# EAGLE design adc_guarded_newinput (EAGLE 5.11)
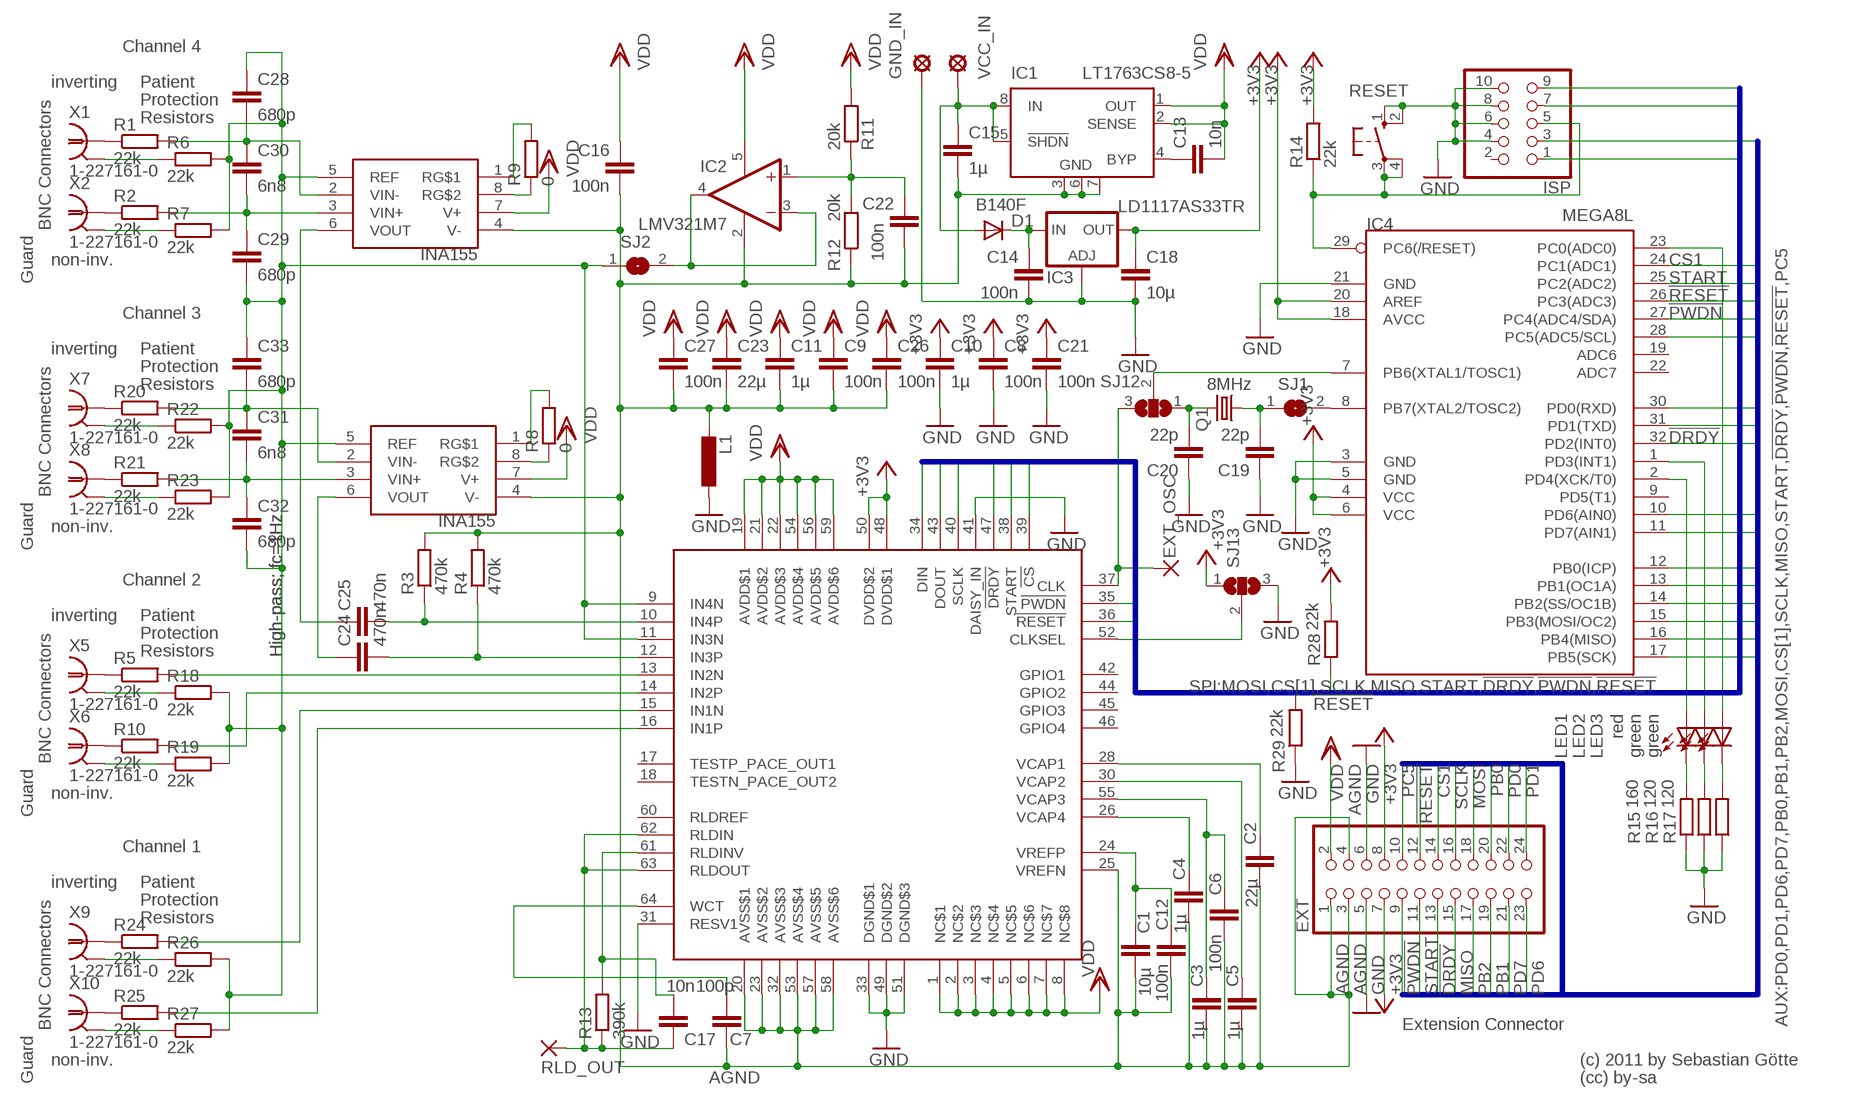
[diagram p0: schematic, sheet 1]

## Parts
C1  10µ  C-EUC0805K  [C0805K]
C2  22µ  C-EUC1206  [C1206]
C3  1µ  C-EUC0805K  [C0805K]
C4  1µ  C-EUC0805K  [C0805K]
C5  1µ  C-EUC0805K  [C0805K]
C6  100n  C-EUC0805K  [C0805K]
C7  100p  C-EUC0805K  [C0805K]
C8  100n  C-EUC0805K  [C0805K]
C9  100n  C-EUC0805K  [C0805K]
C10  1µ  C-EUC0805  [C0805]
C11  1µ  C-EUC0805K  [C0805K]
C12  100n  C-EUC0805K  [C0805K]
C13  10n  C-EUC0805K  [C0805K]
C14  100n  C-EUC0805K  [C0805K]
C15  1µ  C-EUC0805K  [C0805K]
C16  100n  C-EUC0805  [C0805]
C17  10n  C-EUC0805K  [C0805K]
C18  10µ  C-EUC0805K  [C0805K]
C19  22p  C-EUC0805K  [C0805K]
C20  22p  C-EUC0805K  [C0805K]
C21  100n  C-EUC0805K  [C0805K]
C22  100n  C-EUC0805  [C0805]
C23  22µ  C-EUC1206  [C1206]
C24  470n  C-EUC0805K  [C0805K]
C25  470n  C-EUC0805K  [C0805K]
C26  100n  C-EUC0805K  [C0805K]
C27  100n  C-EUC0805K  [C0805K]
C28  680p  C-EUC0805  [C0805]
C29  680p  C-EUC0805  [C0805]
C30  6n8  C-EUC0805  [C0805]
C31  6n8  C-EUC0805  [C0805]
C32  680p  C-EUC0805  [C0805]
C33  680p  C-EUC0805  [C0805]
D1  B140F  DIODE-DO214AC  [DO214AC]
EXT  PINHD-2X12  [2X12]
EXT_OSC  1,6/0,8  [1,6/0,8]
GND_IN  MCS10B  [MCS10B]
IC1  LT1763CS8-5  LT1763CS8-3.3  [SOIC8]
IC2  LMV321M7  [SC70-5L]
IC3  LD1117AS33TR  LD117AS33TR  [SOT223]
IC4  MEGA8L  MEGA8-AI  [TQFP32-08]
ISP  PINHD-2X5  [2X05]
L1  L-EUPIS2816  [PIS2816]
LED1  red  LEDCHIPLED_1206  [CHIPLED_1206]
LED2  green  LEDCHIPLED_1206  [CHIPLED_1206]
LED3  green  LEDCHIPLED_1206  [CHIPLED_1206]
Q1  8MHz  CRYSTALHC49UP  [HC49UP]
R1  22k  R-EU_R1206  [R1206]
R2  22k  R-EU_R1206  [R1206]
R3  470k  R-EU_R1206  [R1206]
R4  470k  R-EU_R1206  [R1206]
R5  22k  R-EU_R1206  [R1206]
R6  22k  R-EU_R1206  [R1206]
R7  22k  R-EU_R1206  [R1206]
R8  0  R-EU_R1206  [R1206]
R9  0  R-EU_R1206  [R1206]
R10  22k  R-EU_R1206  [R1206]
R11  20k  R-EU_R1206  [R1206]
R12  20k  R-EU_R1206  [R1206]
R13  390k  R-EU_R1206  [R1206]
R14  22k  R-EU_R1206  [R1206]
R15  160  R-EU_R1206  [R1206]
R16  120  R-EU_R1206  [R1206]
R17  120  R-EU_R1206  [R1206]
R18  22k  R-EU_R1206  [R1206]
R19  22k  R-EU_R1206  [R1206]
R20  22k  R-EU_R1206  [R1206]
R21  22k  R-EU_R1206  [R1206]
R22  22k  R-EU_R1206  [R1206]
R23  22k  R-EU_R1206  [R1206]
R24  22k  R-EU_R1206  [R1206]
R25  22k  R-EU_R1206  [R1206]
R26  22k  R-EU_R1206  [R1206]
R27  22k  R-EU_R1206  [R1206]
R28  22k  R-EU_R1206  [R1206]
R29  22k  R-EU_R1206  [R1206]
RESET  10-XX  [B3F-10XX]
RLD_OUT  2,54/1,0  [2,54/1,0]
SJ1  SJ  [SJ]
SJ2  SJ  [SJ]
SJ12  SJ2W  [SJ_2]
SJ13  SJ2W  [SJ_2]
U$1  ADS1194  [TQFP-64]
U$2  INA155  [SO-08]
U$3  INA155  [SO-08]
VCC_IN  MCS10B  [MCS10B]
X1  1-227161-0  [AMP_227161]
X2  1-227161-0  [AMP_227161]
X5  1-227161-0  [AMP_227161]
X6  1-227161-0  [AMP_227161]
X7  1-227161-0  [AMP_227161]
X8  1-227161-0  [AMP_227161]
X9  1-227161-0  [AMP_227161]
X10  1-227161-0  [AMP_227161]

## Nets
!DRDY: EXT.13 IC4.32(PD2(INT0)) U$1.47(!DRDY)
!PWDN: EXT.9 IC4.27(PC4(ADC4/SDA)) U$1.35(!PWDN)
!RESET: EXT.12 IC4.26(PC3(ADC3)) R29.2 U$1.36(!RESET)
+3V3: C8.1 C10.1 C18.1 C21.1 EXT.7 EXT.8 IC3.4(OUT) IC4.4(VCC) IC4.6(VCC) IC4.18(AVCC) IC4.20(AREF) R14.2 R28.2 SJ13.1 U$1.48(DVDD$1) U$1.50(DVDD$2)
AGND: C1.2 C2.2 C3.2 C4.2 C5.2 C6.2 C7.1 C9.2 C11.2 C12.2 C15.2 C16.2 C22.2 C23.2 C26.2 C27.2 EXT.1 EXT.3 EXT.4 IC1.3(GND) IC1.6(GND) IC1.7(GND) IC2.2(V-) L1.2 R3.2 R4.2 R12.1 U$1.20(AVSS$1) U$1.23(AVSS$2) U$1.25(VREFN) U$1.32(AVSS$3) U$1.53(AVSS$4) U$1.57(AVSS$5) U$1.58(AVSS$6) U$2.4(V-) U$3.4(V-)
CLK: EXT_OSC.1(P) SJ12.3 U$1.37(CLK)
CLKSEL: SJ13.2 U$1.52(CLKSEL)
CS1: EXT.14 IC4.24(PC1(ADC1)) R28.1 U$1.39(!CS)
GND: C8.2 C10.2 C14.2 C18.2 C19.1 C20.1 C21.2 EXT.5 EXT.6 GND_IN.MP IC3.1(ADJ) IC4.3(GND) IC4.5(GND) IC4.21(GND) ISP.4 ISP.6 ISP.8 ISP.10 L1.1 R15.1 R16.1 R17.1 R29.1 RESET.1(S) RESET.2(S1) SJ13.3 U$1.31(RESV1) U$1.33(DGND$1) U$1.41(DAISY_IN) U$1.49(DGND$2) U$1.51(DGND$3)
MISO: EXT.15 IC4.16(PB4(MISO)) ISP.9 U$1.43(DOUT)
MOSI: EXT.18 IC4.15(PB3(MOSI/OC2)) ISP.1 U$1.34(DIN)
N$1: C2.1 U$1.28(VCAP1)
N$2: C4.1 U$1.26(VCAP4)
N$3: C7.2 U$1.64(WCT)
N$4: C5.1 U$1.30(VCAP2)
N$5: C3.1 C6.1 U$1.55(VCAP3)
N$6: C1.1 C12.1 U$1.24(VREFP)
N$7: R9.1 U$2.8(RG$2)
N$8: IC2.3(-IN) IC2.4(OUT) SJ2.2
N$9: C25.2 R3.1 U$1.10(IN4P)
N$10: C14.1 D1.C IC3.3(IN)
N$11: R5.2 U$1.13(IN2N)
N$12: C29.1 C30.2 R2.2 U$2.3(VIN+)
N$13: C28.2 C30.1 R1.2 U$2.2(VIN-)
N$14: R5.1 X5.1
N$15: R10.1 X6.1
N$16: C13.1 IC1.4(BYP)
N$17: R1.1 X1.1
N$18: R2.1 X2.1
N$19: R9.2 U$2.1(RG$1)
N$20: C25.1 U$2.6(VOUT)
N$21: R19.1 X6.2(GND)
N$22: R18.1 X5.2(GND)
N$23: R20.1 X7.1
N$24: R10.2 U$1.14(IN2P)
N$25: R8.2 U$3.1(RG$1)
N$26: C24.1 U$3.6(VOUT)
N$27: R21.1 X8.1
N$28: C31.1 C33.2 R20.2 U$3.2(VIN-)
N$29: C31.2 C32.1 R21.2 U$3.3(VIN+)
N$30: R7.1 X2.2(GND)
N$31: R6.1 X1.2(GND)
N$32: C24.2 R4.1 U$1.12(IN3P)
N$33: R8.1 U$3.8(RG$2)
N$34: C17.2 R13.2 U$1.61(RLDINV)
N$35: C20.2 Q1.2 SJ12.1
N$36: R24.2 U$1.15(IN1N)
N$37: R25.2 U$1.16(IN1P)
N$38: C19.2 Q1.1 SJ1.1
N$40: IC4.7(PB6(XTAL1/TOSC1)) SJ12.2
N$41: IC4.23(PC0(ADC0)) LED3.A
N$42: IC4.1(PD3(INT1)) LED2.A
N$43: IC4.2(PD4(XCK/T0)) LED1.A
N$44: LED1.C R15.2
N$45: LED2.C R16.2
N$46: LED3.C R17.2
N$48: IC4.8(PB7(XTAL2/TOSC2)) SJ1.2
N$51: C28.1 C29.2 C32.2 C33.1 R6.2 R7.2 R18.2 R19.2 R22.2 R23.2 R26.2 R27.2 SJ2.1 U$1.9(IN4N) U$1.11(IN3N) U$2.5(REF) U$3.5(REF)
N$58: R23.1 X8.2(GND)
N$59: R22.1 X7.2(GND)
N$63: R24.1 X9.1
N$64: R25.1 X10.1
N$65: R27.1 X10.2(GND)
N$66: R26.1 X9.2(GND)
PB0: EXT.20 IC4.12(PB0(ICP))
PB1: EXT.19 IC4.13(PB1(OC1A))
PB2: EXT.17 IC4.14(PB2(SS/OC1B))
PC5: EXT.10 IC4.28(PC5(ADC5/SCL))
PD0: EXT.22 IC4.30(PD0(RXD))
PD1: EXT.24 IC4.31(PD1(TXD))
PD6: EXT.23 IC4.10(PD6(AIN0)) ISP.3
PD7: EXT.21 IC4.11(PD7(AIN1))
REF_NODE: C22.1 IC2.1(+IN) R11.1 R12.2
RLD_OUT: C17.1 R13.1 RLD_OUT.1(P) U$1.62(RLDIN) U$1.63(RLDOUT)
SCLK: EXT.16 IC4.17(PB5(SCK)) ISP.7 U$1.40(SCLK)
START: EXT.11 IC4.25(PC2(ADC2)) U$1.38(START)
UCRESET: IC4.29(PC6(/RESET)) ISP.5 R14.1 RESET.3(P) RESET.4(P1)
VCC_IN: C15.1 D1.A IC1.5(!SHDN) IC1.8(IN) VCC_IN.MP
VDD: C9.1 C11.1 C13.2 C16.1 C23.1 C26.1 C27.1 EXT.2 IC1.1(OUT) IC1.2(SENSE) IC2.5(V+) R11.2 U$1.1(NC$1) U$1.2(NC$2) U$1.3(NC$3) U$1.4(NC$4) U$1.5(NC$5) U$1.6(NC$6) U$1.7(NC$7) U$1.8(NC$8) U$1.19(AVDD$1) U$1.21(AVDD$2) U$1.22(AVDD$3) U$1.54(AVDD$4) U$1.56(AVDD$5) U$1.59(AVDD$6) U$2.7(V+) U$3.7(V+)
Unconnected: IC4.9(PD5(T1)) IC4.19(ADC6) IC4.22(ADC7) ISP.2 U$1.17(TESTP_PACE_OUT1) U$1.18(TESTN_PACE_OUT2) U$1.42(GPIO1) U$1.44(GPIO2) U$1.45(GPIO3) U$1.46(GPIO4) U$1.60(RLDREF)

## Buses
SPI:MOSI,CS[1],SCLK,MISO,START,!DRDY,!PWDN,!RESET
AUX:PD0,PD1,PD6,PD7,PB0,PB1,PB2,MOSI,CS[1],SCLK,MISO,START,!DRDY,!PWDN,!RESET,PC5

## Notes on the sheet
- Channel 4
- inverting | Patient
- Protection
- Resistors
- BNC Connectors
- INA155
- non-inv.
- Guard
- Channel 3
- inverting | Patient
- Protection
- Resistors
- BNC Connectors
- INA155
- non-inv.
- Guard
- Channel 2
- inverting | Patient
- Protection
- Resistors | High-pass; fc=1Hz | High-pass; fc=1Hz
- BNC Connectors
- non-inv.
- Guard
- Channel 1
- inverting | Patient
- Protection
- Resistors
- BNC Connectors | Extension Connector
- non-inv. | (c) 2011 by Sebastian Götte
- Guard | AGND | (cc) by-sa

## Library data of the parts
C1-C33 = rcl:C-EU: CAPACITOR, European symbol
D1 = diode:DIODE-: DIODE
EXT = pinhead:PINHD-2X12: PIN HEADER
EXT_OSC = wirepad:1,6/0,8: THROUGH-HOLE PAD
GND_IN VCC_IN = solpad:MCS10B: SOLDER PAD MC S1, distributor Buerklin, 15F505
IC1 = linear-technology:LT1763CS8: 500mA, Low Noise, LDO Micropower Regulators Source: http://cds.linear.com/docs/Datasheet/1763ff.pdf
IC2 = linear:LMV321?*: General Purpose, Low Voltage, Rail-to-Rail Output Operational Amplifiers Source: http://www.national.com/mpf/LM/LMV321.html http://www.national.com/dt/lmv_qual.pdf
IC3 = v-reg:LD117A?*: Low drop fixed and adjustable positive voltage regulators 1 A Source: http://www.st.com/stonline/products/literature/ds/7194/ld1117axx.pdf
IC4 = atmel:MEGA8: MICROCONTROLLER 8 Kbytes FLASH, 1 kbytes SRAM, 512 bytes EEPROM, USART, 6-channel 10 bit ADC, 2-channel 8 bit ADC Pin compatible with Atmega48, ATMega88, ATMega168 Source: avr.lbr
ISP = pinhead:PINHD-2X5: PIN HEADER
L1 = rcl:L-EU: INDUCTOR, European symbol
LED1-LED3 = led:LED: LED OSRAM: - CHIPLED LG R971, LG N971, LY N971, LG Q971, LY Q971, LO R971, LY R971 LH N974, LH R974 LS Q976, LO Q976, LY Q976 LO Q996 - Hyper CHIPLED LW Q18S LB Q993, LB Q99A, LB R99A - SideLED LS A670, LO A670, LY A670, LG A670, LP A670 LB A673, LV A673, LT A673, LW A673 LH A674 LY A675 LS A676, LA A676, LO A676, LY A676, LW A676 LS A679, LY A679, LG A679 - Hyper Micro SIDELED® LS Y876, LA Y876, LO Y876, LY Y876 LT Y87S - SmartLED LW L88C, LW L88S LB L89C, LB L89S, LG L890 LS L89K, LO L89K, LY L89K LS L896, LA L896, LO L896, LY L896 - TOPLED LS T670, LO T670, LY T670, LG T670, LP T670 LSG T670, LSP T670, LSY T670, LOP T670, LYG T670 LG T671, LOG T671, LSG T671 LB T673, LV T673, LT T673, LW T673 LH T674 LS T676, LA T676, LO T676, LY T676, LB T676, LH T676, LSB T676, LW T676 LB T67C, LV T67C, LT T67C, LS T67K, LO T67K, LY T67K, LW E67C LS E67B, LA E67B, LO E67B, LY E67B, LB E67C, LV E67C, LT E67C LW T67C LS T679, LY T679, LG T679 LS T770, LO T770, LY T770, LG T770, LP T770 LB T773, LV T773, LT T773, LW T773 LH T774 LS E675, LA E675, LY E675, LS T675 LS T776, LA T776, LO T776, LY T776, LB T776 LHGB T686 LT T68C, LB T68C - Hyper Mini TOPLED® LB M676 - Mini TOPLED Santana® LG M470 LS M47K, LO M47K, LY M47K Source: http://www.osram.convergy.de LUXEON: - LUMILED® LXK2-PW12-R00, LXK2-PW12-S00, LXK2-PW14-U00, LXK2-PW14-V00 LXK2-PM12-R00, LXK2-PM12-S00, LXK2-PM14-U00 LXK2-PE12-Q00, LXK2-PE12-R00, LXK2-PE12-S00, LXK2-PE14-T00, LXK2-PE14-U00 LXK2-PB12-K00, LXK2-PB12-L00, LXK2-PB12-M00, LXK2-PB14-N00, LXK2-PB14-P00, LXK2-PB14-Q00 LXK2-PR12-L00, LXK2-PR12-M00, LXK2-PR14-Q00, LXK2-PR14-R00 LXK2-PD12-Q00, LXK2-PD12-R00, LXK2-PD12-S00 LXK2-PH12-R00, LXK2-PH12-S00 LXK2-PL12-P00, LXK2-PL12-Q00, LXK2-PL12-R00 Source: www.luxeon.com KINGBRIGHT: KA-3528ASYC Source: www.kingbright.com
Q1 = crystal:CRYSTAL: CRYSTAL
R1-R29 = rcl:R-EU_: RESISTOR, European symbol
RESET = switch-omron:10-XX: OMRON SWITCH; MPN: B3F-1000; OC_FARNELL: 176432; OC_NEWARK: 36M3542
RLD_OUT = wirepad:2,54/1,0: THROUGH-HOLE PAD
SJ1 SJ2 = jumper:SJ: SMD solder JUMPER
SJ12 SJ13 = jumper:SJ2W: SMD solder JUMPER
U$1 = mytexas:ADS1194: Low-Power, 8-Channel, 16-Bit Analog Front-End for Biopotential Measurements for ECG/EEG applications
U$2 U$3 = mytexas:INA155: Single-Supply, Rail-to-Rail Output, CMOS INSTRUMENTATION AMPLIFIER
X1 X2 X5-X10 = con-coax:?227161*: JACK, RIGHT ANGLE, 50 OHM, PCB, BNC Source: amp_227161.pdf

## Board
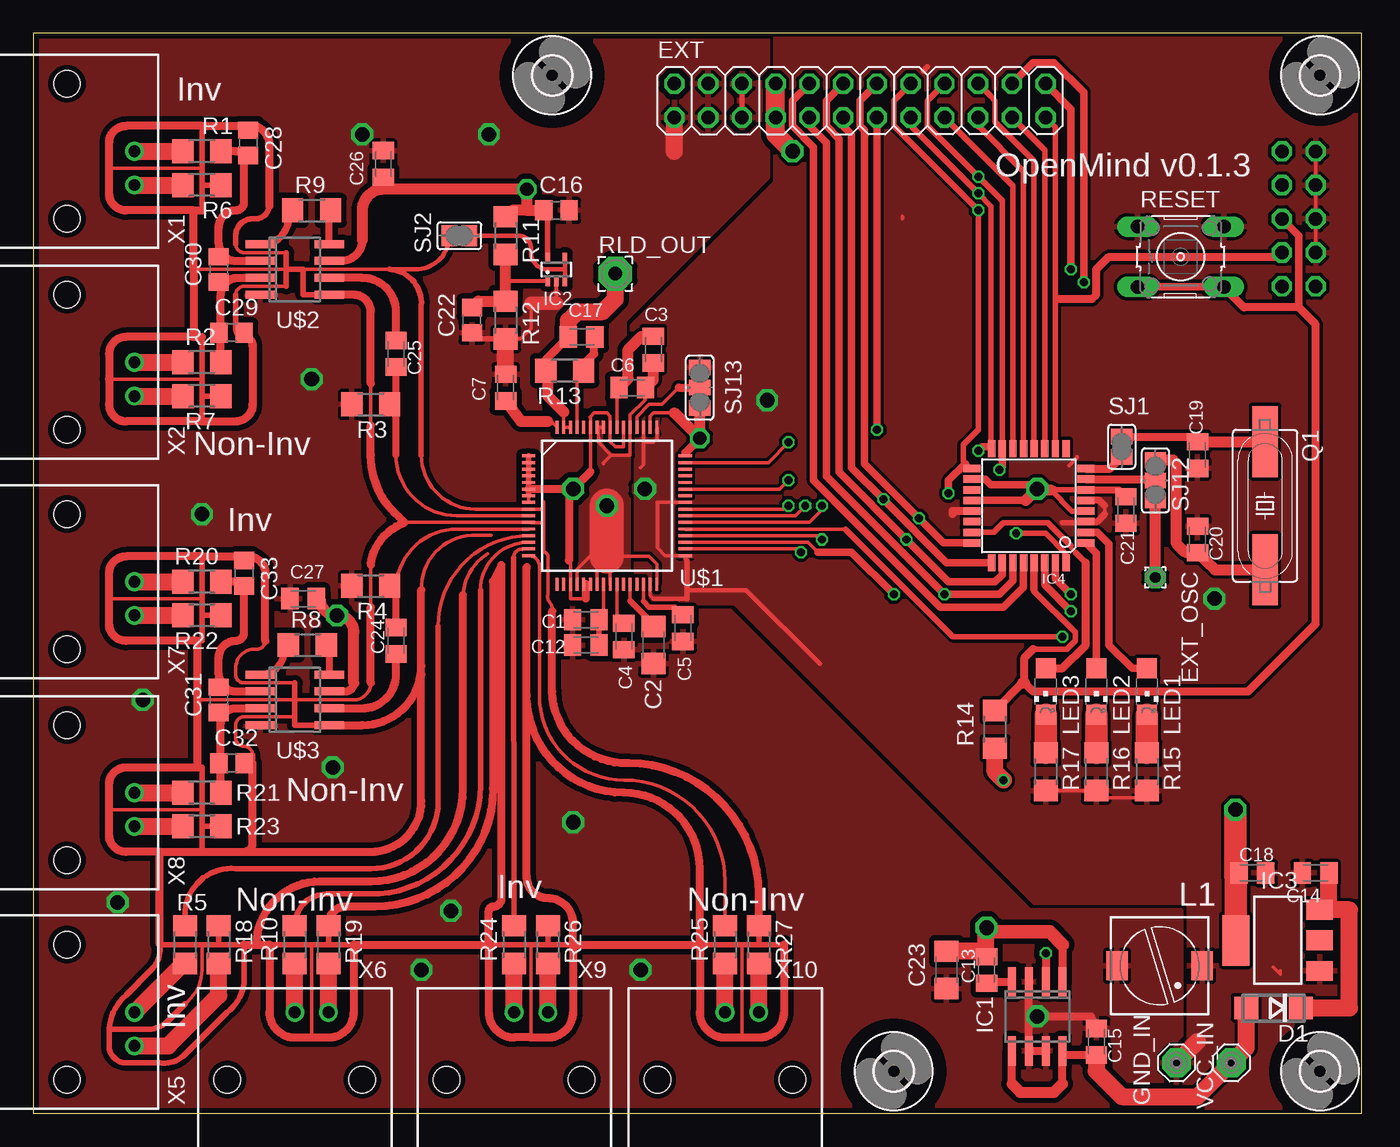
[diagram p1: board, top side]
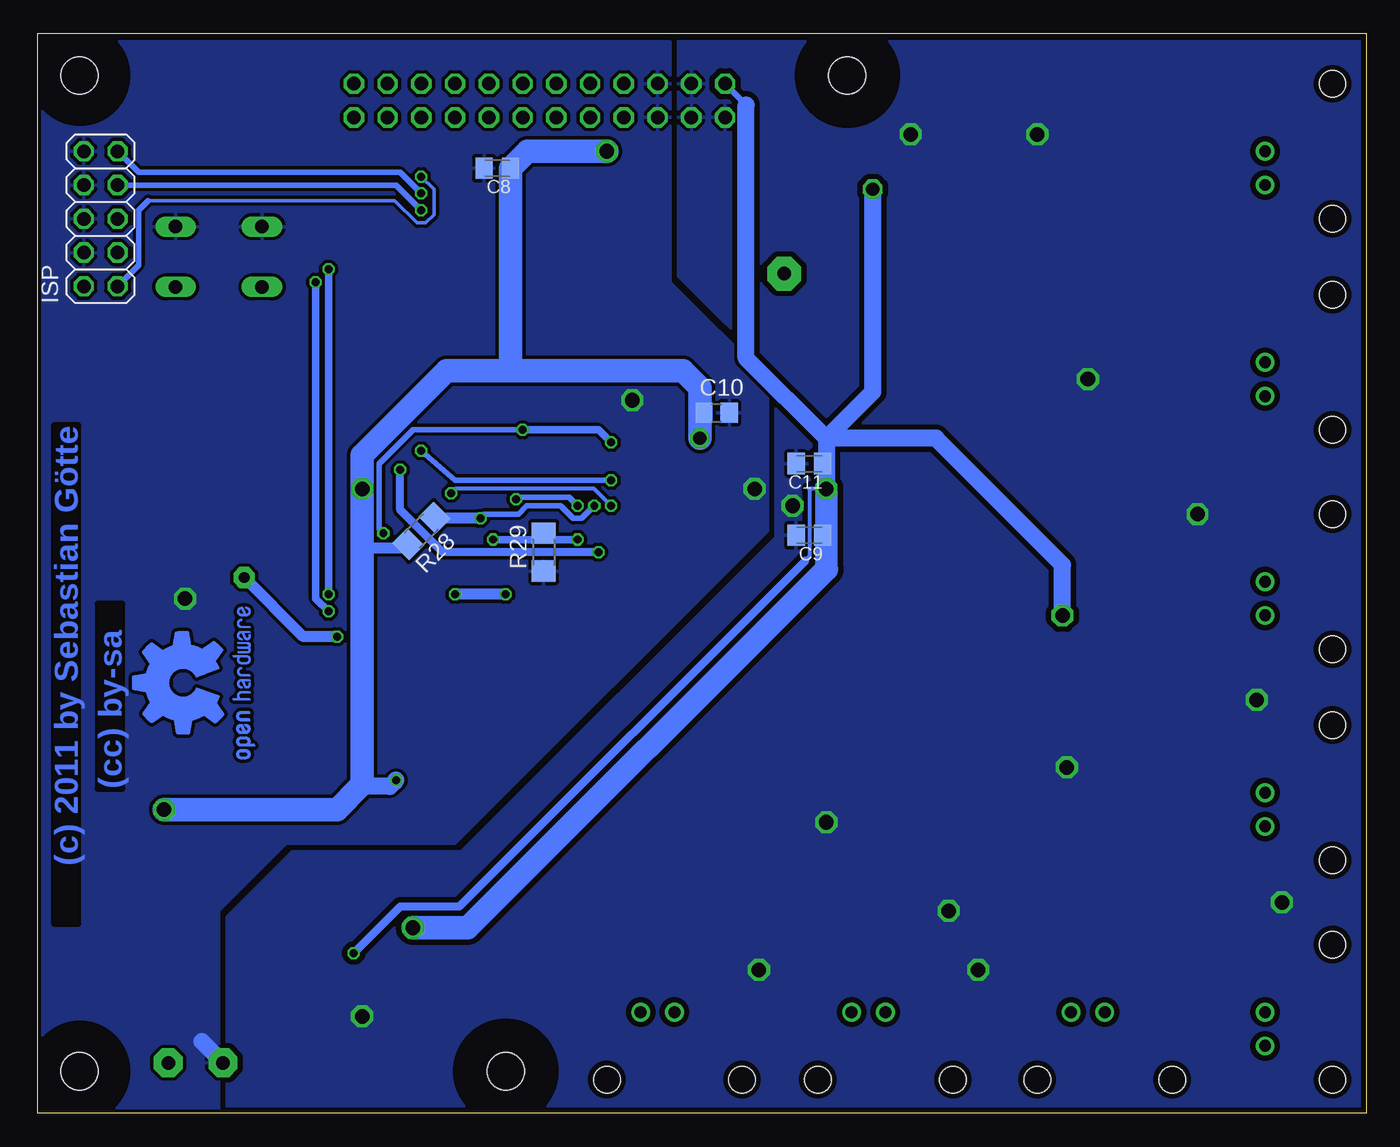
[diagram p2: board, bottom side, seen from below]

Size 100 x 81.27 mm. Coordinates in mm from the lower left corner, seen from the top.
Outline: 0,0 100,0 100,81.27 0,81.27 0,0
Copper layers (1*16): Top 0.035mm / dielectric 1.5mm / Bottom 0.035mm
Design rules "Fusion_eagle_rule_v1.1": minimum track width 6mil, minimum drill 12mil, track to track 6mil, track to pad 6mil, pad to pad 6mil, via to via 6mil, smd to smd 0mil, copper to edge 10mil, drill to drill 10mil, minimum pad ring 10mil, minimum via ring 6mil, stop-mask expansion 2mil, vias tented up to drill 100mil, thermal gap 10mil

### Footprints (pad centres in the part's own frame; a part is rotated, then mirrored left to right if it is on the bottom)
C0805K = smd 1.3 x 1.6: 1 -1,0; 2 1,0
C1206 = smd 1.6 x 1.8: 1 -1.4,0; 2 1.4,0
C0805 = smd 1.3 x 1.5: 1 -0.95,0; 2 0.95,0
DO214AC = smd 1.8 x 1.7: A 2.05,0; C -2.05,0
2X12 = drill 1.016 octagon: 1 -13.97,-1.27; 2 -13.97,1.27; 3 -11.43,-1.27; 4 -11.43,1.27; 5 -8.89,-1.27; 6 -8.89,1.27; 7 -6.35,-1.27; 8 -6.35,1.27; 9 -3.81,-1.27; 10 -3.81,1.27; 11 -1.27,-1.27; 12 -1.27,1.27; 13 1.27,-1.27; 14 1.27,1.27; 15 3.81,-1.27; 16 3.81,1.27; 17 6.35,-1.27; 18 6.35,1.27; 19 8.89,-1.27; 20 8.89,1.27; 21 11.43,-1.27; 22 11.43,1.27; 23 13.97,-1.27; 24 13.97,1.27
1,6/0,8 = drill 0.813 pad 1.6 octagon: 1 0,0
MCS10B = drill 1.016 pad 2.159 octagon: MP 0,0
SOIC8 = smd 0.6 x 2.2: 1 -1.905,-2.6; 2 -0.635,-2.6; 3 0.635,-2.6; 4 1.905,-2.6; 5 1.905,2.6; 6 0.635,2.6; 7 -0.635,2.6; 8 -1.905,2.6
SC70-5L = smd 0.35 x 0.8: 1 -0.65,-0.85; 2 0,-0.85; 3 0.65,-0.85; 4 0.65,0.85; 5 -0.65,0.85
SOT223 = smd 1.5 x 2: 1 -2.3,-3.15; 2 0,-3.15; 3 2.3,-3.15 | smd 3.8 x 2: 4 0,3.15
TQFP32-08 = smd 1.27 x 0.559: 1 -4.293,2.8; 2 -4.293,2; 3 -4.293,1.2; 4 -4.293,0.4; 5 -4.293,-0.4; 6 -4.293,-1.2; 7 -4.293,-2; 8 -4.293,-2.8; 17 4.293,-2.8; 18 4.293,-2; 19 4.293,-1.2; 20 4.293,-0.4; 21 4.293,0.4; 22 4.293,1.2; 23 4.293,2; 24 4.293,2.8 | smd 0.559 x 1.27: 9 -2.8,-4.293; 10 -2,-4.293; 11 -1.2,-4.293; 12 -0.4,-4.293; 13 0.4,-4.293; 14 1.2,-4.293; 15 2,-4.293; 16 2.8,-4.293; 25 2.8,4.293; 26 2,4.293; 27 1.2,4.293; 28 0.4,4.293; 29 -0.4,4.293; 30 -1.2,4.293; 31 -2,4.293; 32 -2.8,4.293
2X05 = drill 1.016 octagon: 1 -5.08,-1.27; 2 -5.08,1.27; 3 -2.54,-1.27; 4 -2.54,1.27; 5 0,-1.27; 6 0,1.27; 7 2.54,-1.27; 8 2.54,1.27; 9 5.08,-1.27; 10 5.08,1.27
PIS2816 = smd 2.2 x 1.6: 1 0,3.2; 2 0,-3.2
CHIPLED_1206 = smd 1.5 x 1.5: A 0,-1.75; C 0,1.75
HC49UP = smd 5.334 x 1.93: 1 -4.826,0; 2 4.826,0
R1206 = smd 1.6 x 1.803: 1 -1.422,0; 2 1.422,0
B3F-10XX = drill 1.016 long: 1 -3.251,2.261; 2 3.251,2.261; 3 -3.251,-2.261; 4 3.251,-2.261
2,54/1,0 = drill 1.016 pad 2.54 octagon: 1 0,0
SJ = smd 1.168 x 1.6: 1 -0.762,0; 2 0.762,0
SJ_2 = smd 1.168 x 1.6: 1 -1.524,0; 2 0,0; 3 1.524,0
TQFP-64 = smd 1 x 0.22: 1 -5.9,3.75; 2 -5.9,3.25; 3 -5.9,2.75; 4 -5.9,2.25; 5 -5.9,1.75; 6 -5.9,1.25; 7 -5.9,0.75; 8 -5.9,0.25; 9 -5.9,-0.25; 10 -5.9,-0.75; 11 -5.9,-1.25; 12 -5.9,-1.75; 13 -5.9,-2.25; 14 -5.9,-2.75; 15 -5.9,-3.25; 16 -5.9,-3.75; 33 5.9,-3.75; 34 5.9,-3.25; 35 5.9,-2.75; 36 5.9,-2.25; 37 5.9,-1.75; 38 5.9,-1.25; 39 5.9,-0.75; 40 5.9,-0.25; 41 5.9,0.25; 42 5.9,0.75; 43 5.9,1.25; 44 5.9,1.75; 45 5.9,2.25; 46 5.9,2.75; 47 5.9,3.25; 48 5.9,3.75 | smd 0.22 x 1: 17 -3.75,-5.9; 18 -3.25,-5.9; 19 -2.75,-5.9; 20 -2.25,-5.9; 21 -1.75,-5.9; 22 -1.25,-5.9; 23 -0.75,-5.9; 24 -0.25,-5.9; 25 0.25,-5.9; 26 0.75,-5.9; 27 1.25,-5.9; 28 1.75,-5.9; 29 2.25,-5.9; 30 2.75,-5.9; 31 3.25,-5.9; 32 3.75,-5.9; 49 3.75,5.9; 50 3.25,5.9; 51 2.75,5.9; 52 2.25,5.9; 53 1.75,5.9; 54 1.25,5.9; 55 0.75,5.9; 56 0.25,5.9; 57 -0.25,5.9; 58 -0.75,5.9; 59 -1.25,5.9; 60 -1.75,5.9; 61 -2.25,5.9; 62 -2.75,5.9; 63 -3.25,5.9; 64 -3.75,5.9
SO-08 = smd 0.6 x 2.2: 1 -1.905,-2.6; 2 -0.635,-2.6; 3 0.635,-2.6; 4 1.905,-2.6; 5 1.905,2.6; 6 0.635,2.6; 7 -0.635,2.6; 8 -1.905,2.6
2,8 = hole 2.8: 0,0
AMP_227161 = drill 0.9 pad 1.27 round: 1 0,-5.08; 2 -2.54,-5.08 | hole 2: -5.08,0; 5.08,0

### Placement (x,y rotation side)
C1  41.59,37.15 180 top
C2  46.67,35.24 270 top
C3  46.67,57.47 270 top
C4  44.45,35.88 270 top
C5  48.9,36.51 270 top
C6  45.09,54.61 0 top
C7  35.56,54.61 270 top
C8  65.41,71.12 180 bottom
C9  41.91,43.5 180 bottom
C10  48.9,52.7 0 bottom
C11  41.91,48.9 180 bottom
C12  41.59,35.24 180 top
C13  71.75,10.79 90 top
C14  96.52,18.1 180 top
C15  80.01,5.4 90 top
C16  39.37,67.94 0 top
C17  41.27,58.42 0 top
C18  91.76,18.1 0 top
C19  87.63,49.53 90 top
C20  87.63,43.18 270 top
C21  82.23,45.4 270 top
C22  33.02,59.69 270 top
C23  68.74,10.79 270 top
C24  27.3,35.56 90 top
C25  27.3,57.15 270 top
C26  26.35,71.44 90 top
C27  20.32,38.73 180 top
C28  16.19,73.03 270 top
C29  14.92,58.74 0 top
C30  13.97,63.5 270 top
C31  13.97,31.11 270 top
C32  14.92,26.35 0 top
C33  15.88,40.64 270 top
D1  93.34,7.94 180 top
E$1  [OSHW1]  81.92,26.04 90 bottom
EXT  62.23,76.2 0 top
EXT_OSC  84.45,40.32 0 top
GND_IN  86.04,3.81 0 top
IC1  75.56,7.3 180 top
IC2  39.37,63.5 0 top
IC3  93.66,13.02 90 top
IC4  74.93,45.72 180 top
ISP  95.25,67.31 90 bottom
L1  84.77,11.11 270 top
LED1  83.82,31.75 180 top
LED2  80.01,31.75 180 top
LED3  76.2,31.75 180 top
Q1  92.71,45.72 270 top
R1  12.7,72.39 0 top
R2  12.7,56.52 0 top
R3  25.4,53.34 180 top
R4  25.4,39.69 180 top
R5  11.43,12.7 90 top
R6  12.7,69.85 0 top
R7  12.7,53.98 0 top
R8  20.64,35.24 180 top
R9  20.95,67.94 180 top
R10  19.68,12.7 90 top
R11  35.56,66.04 90 top
R12  35.56,59.69 90 top
R13  40.01,55.88 0 top
R14  72.39,28.89 270 top
R15  83.82,25.72 90 top
R16  80.01,25.72 90 top
R17  76.2,25.72 90 top
R18  13.97,12.7 90 top
R19  22.23,12.7 90 top
R20  12.7,40.01 0 top
R21  12.7,24.13 0 top
R22  12.7,37.47 0 top
R23  12.7,21.59 0 top
R24  36.2,12.7 90 top
R25  52.07,12.7 90 top
R26  38.73,12.7 90 top
R27  54.61,12.7 90 top
R28  71.12,43.81 225 bottom
R29  61.91,42.23 90 bottom
RESET  86.36,64.45 0 top
RLD_OUT  43.81,63.18 0 top
SJ1  81.92,50.16 270 top
SJ2  32.07,66.04 0 top
SJ12  84.45,47.62 270 top
SJ13  50.16,54.61 90 top
U$1  43.18,45.72 0 top
U$2  19.68,63.5 270 top
U$3  19.68,31.11 270 top
U$4  [2,8]  96.84,78.11 0 top
U$5  [2,8]  96.84,3.17 0 top
U$6  [2,8]  39.05,78.11 0 top
U$7  [2,8]  64.77,3.17 0 top
VCC_IN  90.17,3.81 0 top
X1  2.54,72.39 90 top
X2  2.54,56.52 90 top
X5  2.54,7.62 90 top
X6  19.68,2.54 180 top
X7  2.54,40.01 90 top
X8  2.54,24.13 90 top
X9  36.2,2.54 180 top
X10  52.07,2.54 180 top

### Tracks (layer width: path | path; a pad name or v marks a point on that pad's centre or on a via)
!DRDY  (via drill 0.6)
  Top 0.254: U$1.47 55.32,48.97 v56.83,50.48
  Top 0.406: IC4.32 77.73,42.13 76.2,43.66 v73.98,43.66
  Top 0.559: v63.5,51.44 EXT.13
  Bottom 0.406: v73.98,43.66 74.3,43.97 74.3,48.9 71.75,51.44 v63.5,51.44
  Bottom 0.559: v56.83,50.48 57.78,51.44 v63.5,51.44
!PWDN  (via drill 0.6)
  Top 0.254: U$1.35 58.31,42.97 59.05,42.23
  Top 0.559: EXT.9 58.42,74.3 59.69,73.03 59.69,47.94 v68.58,39.05 72.71,39.05 73.73,40.08 IC4.27 | 59.05,42.23 61.59,42.23 v64.77,39.05
  Bottom 0.813: v64.77,39.05 v68.58,39.05
!RESET  (via drill 0.6)
  Top 0.254: U$1.36 59.03,43.47 v59.37,43.18
  Top 0.559: IC4.26 72.93,40.55 72.39,40.01 68.9,40.01 v65.72,43.18 60.64,48.26 60.64,73.34 59.69,74.3 59.69,76.2 EXT.12
  Bottom 0.254: 62.08,43.18 R29.2
  Bottom 0.559: v59.37,43.18 62.08,43.18 v65.72,43.18
+3V3  (via drill 0.6, 1, 1.1)
  Top 0.254: v75.56,46.99 75.64,46.92 | 49.08,49.72 U$1.48 49.02,49.53 | U$1.50 46.43,52.46 46.67,52.7 48.26,52.7
  Top 0.406: 76.83,46.92 IC4.6 | 78.44,45.32 IC4.4 78.19,45.32 76.59,46.92 | v75.56,46.99 75.25,47.31
  Top 0.508: C21.1 81.72,46.92 IC4.6
  Top 0.559: 74.69,46.12 IC4.20 | IC4.18 71.66,47.72 72.07,47.31 75.25,47.31
  Top 0.61: 76.52,46.92 76.83,46.92 | v50.16,50.8 49.08,49.72
  Top 0.813: 75.64,46.92 76.52,46.92 76.59,46.92 | v75.56,46.99 74.69,46.12 | SJ13.1 v50.16,50.8 48.26,52.7
  Top 1.016: 90.51,17.71 C18.1 90.49,17.83
  Top 1.27: R14.2 72.39,25.72 v73.03,25.08
  Top 1.422: EXT.8 EXT.7 55.88,73.66 v57.15,72.39
  Top 1.676: 90.51,17.71 IC3.4 | v90.49,22.86 90.49,17.83
  Bottom 0.254: 69.22,55.88 64.41,56.24 | C10.1 49.84,52.77 SJ13.1 | 72.39,42.55 R28.2
  Bottom 0.813: 75.56,42.55 72.39,42.55
  Bottom 1.27: v73.03,25.08 73.5,24.61 75.72,24.61
  Bottom 1.778: v50.16,50.8 SJ13.1 50.16,54.61 51.44,55.88 69.22,55.88 75.56,49.53 v75.56,46.99 75.56,42.55 75.56,24.77 75.72,24.61 77.47,22.86 v90.49,22.86 | 64.41,56.24 C8.1 63.13,72.39 v57.15,72.39
AGND  (via drill 1.1)
  Top 0.254: U$1.20 40.93,40.93 41.91,41.91 42.43,41.39 | U$1.23 42.43,41.39 | 42.43,41.39 42.95,41.91 43.18,41.91 43.43,41.66 U$1.25 43.43,41.52 43.81,41.91 46.35,41.91 46.93,41.34 U$1.32 | R12.1 36.68,58.27 37.47,59.05 37.47,60.96 | U$1.57 U$1.58 42.55,51.51 42.55,50.48 43.5,49.53 | C6.2 46.04,54.56 46.04,53.66 44.93,52.55 U$1.53 44.93,49.53 43.5,49.53 | 43.5,49.53 42.91,48.94 C11.2
  Top 0.305: 39.37,60.96 IC2.2
  Top 0.406: R12.1 33.04,58.27 C22.2
  Top 0.61: IC1.7 IC1.6 74.93,7.3 | 74.93,7.3 IC1.3 | C15.2 79.61,7.3 v75.56,7.3 74.93,7.3
  Top 0.813: C6.2 46.67,55.2 C3.2
  Top 1.016: 37.47,60.96 39.37,60.96
  Top 1.27: 48.26,72.39 EXT.1 | C7.1 R12.1
  Top 2.54: 43.18,41.91 v43.18,45.72
  other vias: 20.95,55.24 40.64,21.91 31.43,15.24 22.54,26.04 34.29,73.66 24.77,73.66 12.7,45.09 8.26,31.11 6.35,15.88 29.21,10.79 45.72,10.79
  pour Top (isolate 0.406): 0,81.28 40.01,81.28 40.01,79.38 38.1,77.47 38.1,51.44 44.77,51.44 44.77,31.11 55.88,31.11 61.59,17.14 61.59,0 0,0
  pour Bottom (isolate 0.406, rank 2): 62.23,80.64 0,80.64 0,0 86.36,0 86.36,20.95 73.03,20.95 73.03,33.02 57.15,33.02 57.15,44.45 45.72,44.45 45.72,53.34 57.78,53.34 57.78,66.04 71.75,66.04 71.75,80.01
  pour Top (isolate 0.406, rank 2): 86.36,0 86.36,15.24 74.93,15.24 52.39,37.78 44.45,37.78 44.45,59.69 55.24,70.48 55.24,81.28 38.1,81.28 38.1,51.44 40.64,48.9 40.64,40.64 39.37,39.37 39.37,28.57 46.99,20.95 57.15,20.95 61.59,17.14 61.59,0
CLK  (via drill 0.6)
  Top 0.254: U$1.37 61.12,43.97
  Top 0.406: v77.47,35.88 69.22,35.88 61.12,43.97
  Top 0.813: EXT_OSC.1 SJ12.3
  Bottom 0.813: EXT_OSC.1 80.01,35.88 v77.47,35.88
CLKSEL
  Top 0.254: U$1.52 45.43,52.41 46.35,53.34 47.31,53.34 48.58,54.61
  Top 0.61: 48.58,54.61 SJ13.2
CS1  (via drill 0.6)
  Top 0.254: U$1.39 57.35,44.97 v58.1,45.72
  Top 0.559: IC4.24 68.52,42.92 v66.67,44.77 62.55,48.9 62.55,73.98 62.23,74.3 62.23,76.2 EXT.14
  Bottom 0.254: 70.06,44.77 R28.1
  Bottom 0.406: v66.67,44.77 66.36,45.09 63.82,45.09 63.18,45.72 60.64,45.72 59.69,44.77 59.05,44.77 v58.1,45.72
  Bottom 0.813: v66.67,44.77 70.06,44.77
GND  (via drill 1.1)
  Top 0.254: ISP.10 ISP.8 ISP.6 ISP.4 | 79.15,44.45 IC4.3 | R17.1 R16.1 80.24,23.75 83.59,23.75 R15.1 83.5,23.98 | 49.21,41.59 49.08,41.73 U$1.33 47.56,41.97 46.99,42.55 46.99,45.97 | 93.85,10.72 93.85,10.48 93.34,10.98 | 46.99,45.97 46.93,45.97 | 46.99,45.97 U$1.41 | 65.41,67.31 65.41,67.5 | 80.64,45.09 80.64,45.72 | U$1.31 46.43,38.98 46.67,38.73 | 45.93,50.48 45.93,48.79 45.72,48.58 | 45.93,50.48 U$1.51 | U$1.49 46.93,50.74 46.67,50.48 45.93,50.48
  Top 0.305: 78.58,49.37 77.95,48.74
  Top 0.356: 46.67,38.73 49.21,38.73 | 59.21,33.82 53.66,39.37 49.21,39.37 49.21,39.69
  Top 0.406: 77.47,44.45 79.15,44.45 | 66.99,78.42 67.31,78.74 | 49.21,38.73 49.21,39.69 49.21,41.59 | EXT.5 EXT.6
  Top 0.508: IC4.5 80.25,46.12 80.64,45.72 | IC4.3 80.08,44.52 80.64,45.09
  Top 0.61: IC4.21 69.22,45.32 69.22,45.09
  Top 1.27: GND_IN.MP 87.63,5.4
  Bottom 1.27: GND_IN.MP 87.63,5.4
  other vias: 46.04,46.99 55.24,53.66 88.9,38.73
  pour Top (isolate 0.254, rank 3): 100.33,81.28 38.73,81.28 38.73,0 100.33,0
  pour Bottom (isolate 0.254): 99.69,80.64 52.39,80.64 52.39,62.55 45.09,55.24 45.09,43.81 68.58,20.32 81.28,20.32 86.36,15.24 86.36,0 99.69,0
MISO  (via drill 0.6)
  Top 0.254: U$1.43 56.18,46.97 v56.83,47.62 | 71.98,50.16 IC4.16
  Top 0.406: EXT.15 66.04,74.3 v71.12,69.22 72.07,68.26 72.07,50.07 IC4.16
  Top 0.559: v71.12,49.85 71.44,50.16 71.98,50.16
  Bottom 0.406: v71.12,69.22 72.71,70.8 92.39,70.8 ISP.9 | v56.83,47.62 68.58,47.62 v71.12,49.85
MOSI  (via drill 0.6)
  Top 0.254: U$1.34 57.54,42.47 v57.78,42.23
  Top 0.406: EXT.18 67.31,76.2 67.31,74.3 v71.12,70.48 72.93,68.67 IC4.15
  Top 0.559: IC4.15 72.93,48.64 v72.71,48.42
  Bottom 0.254: 91.66,68.67 73.12,68.67 71.44,66.99 70.8,66.99 70.17,67.63 70.17,69.53 v71.12,70.48
  Bottom 0.406: 91.66,68.67 92.39,67.94 92.39,63.82 ISP.1
  Bottom 0.61: v72.71,48.42 72.71,45.4 69.53,42.23 v57.78,42.23
N$1
  Top 0.254: 44.93,38.57 U$1.28 | 46.35,37.15 46.35,36.96 C2.1
  Top 0.406: 46.35,37.15 44.93,38.57
N$2
  Top 0.254: 43.93,37.4 U$1.26
  Top 0.406: C4.1 43.93,37.4
N$3
  Top 0.254: 39.43,51.69 U$1.64 38.98,52.07 38.73,52.07
  Top 0.813: C7.2 36.7,52.07 38.73,52.07
N$4
  Top 0.254: U$1.30 45.93,38.52
  Top 0.406: C5.1 48.31,38.1 46.35,38.1 45.93,38.52
N$5
  Top 0.254: 45.77,58.47 C3.1 | U$1.55 43.93,54.45 C6.1
  Top 0.813: C6.1 44.77,55.29 44.77,57.47 45.77,58.47
N$6
  Top 0.254: 42.93,37.48 U$1.24
  Top 0.406: 42.93,37.48 C1.1 C12.1
N$7
  Top 0.508: R9.1 arc-90 22.29,67.4 U$2.8
N$8
  Top 0.356: 40.02,63.5 IC2.3 | 40.02,63.5 IC2.4 | SJ2.2 36.51,66.04 arc-90 37.47,65.09 37.47,64.77 arc90 38.73,63.5 40.02,63.5
N$9
  Top 0.254: U$1.10 31.86,44.97 arc-90 27.3,49.53 | R3.1 27.3,53.34 C25.2
  Top 0.508: 27.3,49.53 C25.2
N$10
  Top 1.27: D1.C 99.06,7.94 99.06,15.32 IC3.3 97.52,15.32 C14.1
N$11
  Top 0.254: 30.48,36.67 arc-90 U$1.13
  Top 0.406: 30.48,36.67 30.48,23.5 arc-90 25.4,18.41 15.24,18.41 arc90 11.43,15.24 R5.2
N$12
  Top 0.254: C30.2 13.97,61.75 14.12,61.59 | C29.1 13.97,58.57 14.12,58.42
  Top 0.61: U$2.3 15.39,62.87 arc90 14.12,61.59 14.12,58.42 R2.2
N$13
  Top 0.254: 15.88,71.75 15.88,71.76 C28.2 | C30.1 13.97,65.41
  Top 0.61: R1.2 15.24,72.39 arc-90 15.88,71.75 15.88,68.58 arc-90 15.24,67.94 arc90 13.97,66.67 13.97,65.41 arc90 15.24,64.14 U$2.2
N$14
  Top 0.254: 11.28,11.28 R5.1
  Top 1.27: X5.1 11.28,11.28
N$15
  Top 1.27: X6.1 R10.1
N$16
  Top 0.61: IC1.4 72.28,9.9 C13.1
N$17
  Top 1.27: X1.1 R1.1
N$18
  Top 1.27: X2.1 R2.1
N$19
  Top 0.508: U$2.1 arc90 19.21,67.22 R9.2
N$20
  Top 0.254: C25.1 27.3,58.42
  Top 0.61: U$2.6 24.77,62.87 arc-90 27.3,60.33 C25.1
N$21
  Top 1.27: X6.2 R19.1
N$22
  Top 1.27: X5.2 10.16,5.08 13.97,8.89 R18.1
N$23
  Top 1.27: X7.1 R20.1
N$24
  Top 0.254: U$1.14 37.26,42.97 arc90 33.66,39.37
  Top 0.406: R10.2 arc-90 22.07,16.51 26.04,16.51 arc90 33.66,25.4 33.66,39.37
N$25
  Top 0.508: U$3.1 arc90 18.9,34.83 R8.2
N$26
  Top 0.61: U$3.6 24.77,30.48 arc90 27.3,33.02 C24.1
N$27
  Top 1.27: X8.1 R21.1
N$28
  Top 0.254: C31.1 13.97,33.02 | 15.88,39.37 C33.2
  Top 0.61: R20.2 15.24,40.01 arc-90 15.88,39.37 15.88,36.2 arc-90 15.24,35.56 arc90 13.97,34.29 13.97,33.02 arc90 15.24,31.75 U$3.2
N$29
  Top 0.254: 14.12,29.36 14.12,30.01 C31.2
  Top 0.406: 14.12,26.35 C32.1
  Top 0.61: U$3.3 15.24,30.48 arc90 14.12,29.36 14.12,26.35 R21.2
N$30
  Top 1.27: X2.2 R7.1
N$31
  Top 1.27: X1.2 R6.1
N$32
  Top 0.254: U$1.12 31.91,43.97 arc90 27.3,39.37 R4.1
  Top 0.508: C24.2 27.3,39.37
N$33
  Top 0.508: U$3.8 22.29,35.02 arc90 R8.1
N$34
  Top 0.254: U$1.61 40.93,55.38 | R13.2 41.43,56.35 | 42.23,58.37 C17.2
  Top 0.305: 40.93,55.38 R13.2
  Top 0.61: 41.43,56.35 42.23,57.15 42.23,58.37
N$35
  Top 0.813: Q1.2 88.97,40.89 C20.2 87.63,42.23 86.68,42.23 86.04,42.86 86.04,48.9 85.79,49.15 SJ12.1
N$36
  Top 0.254: 36.16,41.83 arc-90 36.79,42.46 arc-5 U$1.15
  Top 0.406: R24.2 36.16,41.83
N$37
  Top 0.254: U$1.16 arc-90 38.1,41.15 38.1,31.43 arc90 44.45,25.08 arc-90 52.07,17.46 R25.2
N$38
  Top 0.254: C19.2 87.7,50.55
  Top 0.61: SJ1.1 87.23,50.93 C19.2
  Top 0.813: 87.7,50.55 Q1.1
N$40
  Top 0.406: 84.36,47.72 SJ12.2
  Top 0.61: IC4.7 84.36,47.72
N$41
  Top 0.305: 78.11,42.7 78.11,42.55 78.42,42.23
  Top 0.406: IC4.23 72.3,43.72 73.03,44.45 76.36,44.45 78.11,42.7 | 79.22,41.43 78.42,42.23
  Top 0.61: LED3.A 77.47,33.5 79.22,35.24 79.22,41.43
N$42
  Top 0.559: IC4.1 80.01,42.13 LED2.A
N$43
  Top 0.559: IC4.2 80.11,43.72 80.96,42.86 80.96,35.24 82.7,33.5 LED1.A
N$44
  Top 1.676: R15.2 LED1.C
N$45
  Top 1.676: R16.2 LED2.C
N$46
  Top 1.676: R17.2 LED3.C
N$48
  Top 0.61: IC4.8 81.03,48.52 SJ1.2
N$51
  Top 0.254: 34.21,42.11 33.75,41.78 arc47 32.35,39.01 | R22.2 14.61,36.98 | 19.05,62.23 15.88,62.23 arc90 15.24,61.59 | 19.05,63.5 12.06,63.5 | 19.05,64.77 15.88,64.77 arc-90 15.24,65.41 | 12.7,71.12 5.71,71.12 | 12.7,55.24 5.71,55.24 | 12.7,38.73 5.71,38.73 | 5.71,22.86 12.7,22.86 | 19.68,29.84 15.88,29.84 arc90 15.24,29.21 15.24,28.26 arc90 15.88,27.62 arc-90 16.51,26.99 | 12.38,31.11 19.68,31.11 24.13,31.11 arc90 25.4,32.38 | 20.32,63.5 26.83,63.5 | 29.21,49.53 arc90 33.27,45.47 U$1.9 38.42,45.47 | 17.46,35.56 arc-90 16.83,34.92 arc90 15.24,33.66 15.24,33.02 arc90 15.88,32.38 19.68,32.38 | 25.4,51.75 25.4,54.93 | 25.4,38.1 25.4,41.27 | R19.2 22.71,14.61 | 20.95,12.7 20.95,5.71 | 12.7,12.7 12.7,10.79 arc-53 11.43,8.26 | 37.47,12.7 37.47,5.71 | 53.34,12.7 53.34,5.71 | 29.21,39.37 arc-90 33.02,43.5 34.44,43.5 | 38.42,45.47 38.42,46.04 | 39.05,37.78 arc53 38.89,38.42 arc-53 38.73,39.05 38.73,41.91 arc90 38.42,42.23 38.42,44.45 | 38.42,44.45 38.42,45.47 | U$1.11 27.94,44.47 27.94,44.45 | 38.42,44.45 37.47,44.45 | 15.88,41.91 C33.1 | 16.19,74.3 C28.1 | C29.2 15.87,58.42 15.88,58.42
  Top 0.356: 26.83,63.5 28.77,63.5 arc90 SJ2.1
  Top 0.406: 12.7,21.59 R23.2 | 12.7,21.59 12.7,22.86 12.7,26.04 12.38,26.04 | 12.7,37.47 12.7,35.56 12.38,35.56 | 12.7,37.47 R22.2 | 13.97,53.98 R7.2 12.7,53.98 | 12.7,69.85 R6.2 | 12.7,53.98 12.7,55.24 12.7,58.42 | 12.7,67.94 12.7,69.85 | 12.7,53.98 12.7,52.07 | 19.05,63.5 19.05,62.23 | 19.05,63.5 19.05,64.77 | 12.7,74.3 12.7,71.12 12.7,69.85 | U$2.5 20.32,61.59 20.32,63.5 19.05,63.5 | 29.21,49.53 29.21,60.8 arc90 26.83,63.5 | U$3.5 22.23,29.21 19.68,29.21 19.68,29.84 19.68,31.11 19.68,32.38 | 15.88,41.91 16.19,41.91 | 12.7,41.91 12.7,38.73 12.7,37.47 | 12.7,19.68 12.7,21.59 | 16.19,74.3 16.51,74.3 | 15.24,65.41 15.24,66.04 arc-90 16.51,67.31 arc90 17.78,68.26 | 15.24,61.59 15.24,59.05 arc90 15.88,58.42 | 13.97,12.7 R18.2 | 13.97,12.7 15.88,12.7 15.88,10.16 arc-53 14.61,7.62 11.43,4.45 arc-53 9.53,3.81 6.99,3.81 arc-90 5.71,5.08 5.71,5.71 arc-10 5.71,6.35 | 17.78,12.7 20.95,12.7 22.23,12.7 | 22.23,12.7 R19.2 | 22.23,12.7 24.13,12.7 | 5.71,6.35 arc-44 6.99,8.89 8.89,10.79 arc53 9.53,12.7 12.7,12.7 13.97,12.7 | 11.43,8.26 10.16,6.99 arc-37 8.89,6.35 5.71,6.35 | 54.61,12.7 54.61,13.97 R27.2 | 38.73,12.7 40.64,12.7 | 50.16,12.7 53.34,12.7 54.61,12.7 | 38.73,12.7 R26.2 | 54.61,12.7 56.52,12.7 | 34.29,12.7 37.47,12.7 38.73,12.7 | C32.2 16.51,26.35 16.51,26.99
  Top 0.61: 40.64,12.7 40.64,14.29 arc90 38.73,16.19 arc-90 37.15,17.78 37.15,31.43 | 37.15,31.43 37.15,41.12 | 32.35,39.01 32.35,24.41 arc-90 25.4,17.46 21.59,17.46 arc90 16.83,12.7 | 12.06,58.42 12.7,58.42 | 12.06,58.42 6.99,58.42 arc90 5.71,57.15 5.71,55.24 5.71,53.34 arc90 6.99,52.07 12.7,52.07 15.24,52.07 arc90 16.51,53.34 16.51,57.78 arc90 15.88,58.42 | U$2.5 24.13,61.59 arc-90 25.4,60.33 25.4,54.93 | 15.88,41.91 12.7,41.91 6.99,41.91 arc90 5.71,40.64 5.71,38.73 5.71,36.83 arc90 6.99,35.56 12.38,35.56 12.38,31.11 12.38,26.04 6.99,26.04 arc90 5.71,24.77 5.71,22.86 5.71,20.95 arc90 6.99,19.68 9.53,19.68 | 9.53,19.68 12.7,19.68 15.88,19.68 | 16.51,74.3 arc-90 17.78,72.71 17.78,68.26 | 16.19,74.3 12.7,74.3 6.99,74.3 arc90 5.71,73.03 5.71,71.12 5.71,69.22 arc90 6.99,67.94 12.06,67.94 | 12.06,67.94 12.7,67.94 | 25.4,41.27 arc-63 27.94,44.45 arc3 27.3,45.09 arc-46 25.4,49.53 25.4,51.75 | 15.88,19.68 arc90 16.51,20.32 16.51,26.35 | 16.19,41.91 arc-90 17.46,40.64 17.46,35.56 | 25.4,32.38 25.4,38.1 | 22.23,29.21 24.77,29.21 arc90 29.21,33.66 29.21,39.37 | 15.88,12.7 16.83,12.7 | 16.83,12.7 17.78,12.7 17.78,7.62 arc90 19.68,5.71 20.95,5.71 22.23,5.71 arc90 24.13,7.62 24.13,12.7 34.29,12.7 | 40.64,12.7 50.16,12.7 | 56.52,12.7 56.52,7.62 arc-90 54.61,5.71 53.34,5.71 52.07,5.71 arc-90 50.16,7.62 50.16,12.7 | 40.64,12.7 40.64,7.62 arc-90 38.73,5.71 37.47,5.71 36.2,5.71 arc-90 34.29,7.62 34.29,12.7 | 9.53,12.7 9.53,19.68 | 37.15,31.43 arc90 44.45,24.13 arc-90 50.16,18.41 50.16,12.7 | 54.61,13.97 54.61,16.51 arc90 44.77,26.35 arc-90 39.05,31.75 39.05,37.78 | 34.29,12.7 34.29,15.24 arc-90 34.61,15.56 arc90 35.24,16.19 35.24,41.27 34.61,40.01 34.61,24.45 arc-90 25.72,15.56 23.5,15.56 arc90 22.23,14.29
  Top 0.61: 12.06,67.94 12.06,63.5 12.06,58.42 | 15.88,19.68 25.4,19.68 arc90 29.21,23.5 29.21,33.02
N$58
  Top 1.27: X8.2 R23.1
N$59
  Top 1.27: X7.2 R22.1
N$63
  Top 1.27: X9.1 R24.1
N$64
  Top 1.27: X10.1 R25.1
N$65
  Top 1.27: X10.2 R27.1
N$66
  Top 1.27: X9.2 R26.1
PB0
  Top 0.406: IC4.12 75.33,71.36 75.33,71.67 72.39,74.61 72.39,76.2 72.07,76.52 EXT.20
PB1
  Top 0.406: IC4.13 74.53,70.09 74.53,70.89 71.12,74.3
  Top 0.559: 71.12,74.3 EXT.19
PB2
  Top 0.406: IC4.14 73.73,69.78 EXT.17
PC5
  Top 0.559: IC4.28 74.53,39.6 73.03,38.1 68.26,38.1 58.74,47.62 58.74,72.71 57.15,74.3 57.15,76.2 EXT.10
PD0  (via drill 0.6)
  Top 0.559: IC4.30 76.13,39.76 v78.11,37.78 | EXT.22 75.25,79.06 76.83,79.06 79.06,76.83 v79.06,62.55
  Bottom 0.559: v78.11,37.78 79.06,38.73 v79.06,62.55
PD1  (via drill 0.6)
  Top 0.559: IC4.31 76.93,40.23 v78.11,39.05 | EXT.24 78.11,75.56 v78.11,63.5
  Bottom 0.559: v78.11,39.05 v78.11,63.5
PD6
  Top 0.406: IC4.10 76.93,61.28 | 76.93,61.28 76.93,74.2 EXT.23 | 76.93,61.28 77.15,61.28
  Top 0.61: 77.15,61.28 79.69,61.28 80.01,61.59 80.01,63.5 80.96,64.45 93.66,64.45 ISP.3
PD7
  Top 0.406: IC4.11 76.13,72.3 76.13,72.46 EXT.21
REF_NODE
  Top 0.305: 35.56,62.65 IC2.1
  Top 0.406: R12.2 35.56,61.09
  Top 0.813: R11.1 35.56,62.65 R12.2 33.49,61.11 C22.1
RLD_OUT
  Top 0.254: U$1.62 U$1.63 39.93,52.78
  Top 0.305: 38.73,55.73 R13.1
  Top 0.61: R13.1 38.58,56.73 C17.1
  Top 0.813: 39.93,52.78 38.73,53.98 38.73,55.73
  Top 1.27: C17.1 40.27,59.64 40.96,60.33 42.86,60.33 43.81,61.28 RLD_OUT.1
SCLK  (via drill 0.6)
  Top 0.254: U$1.40 56.58,45.47 v56.83,45.72
  Top 0.406: IC4.17 70.17,48.9 70,49.06 70,50.32 71.12,51.44 v71.12,67.94 64.77,74.3 64.77,76.2 EXT.16
  Top 0.559: v68.9,46.67 68.9,47.62 70.17,48.9
  Bottom 0.305: v68.9,46.67 68.58,46.99 58.1,46.99 v56.83,45.72
  Bottom 0.406: v71.12,67.94 73.03,69.85 ISP.7
START  (via drill 0.6)
  Top 0.254: U$1.38 58.44,44.47 59.37,45.4 v59.37,45.72
  Top 0.559: IC4.25 68.75,41.43 v63.98,46.2 61.59,48.58 61.59,73.66 60.96,74.3 EXT.11
  Bottom 0.254: 63.82,46.35 v63.98,46.2
  Bottom 0.406: 63.82,46.35 60.01,46.35 v59.37,45.72
UCRESET
  Top 0.254: 75.33,39.29 75.33,39.45
  Top 0.305: 89.61,62.15 RESET.4
  Top 0.406: 75.25,34.92 77.79,34.92 78.42,35.56 78.42,36.2 75.33,39.29
  Top 0.559: 75.33,39.45 IC4.29 | RESET.4 RESET.3 | ISP.5 95.25,66.04 95.25,60.64
  Top 0.61: 75.25,34.92 74.61,34.29 74.61,32.38 75.25,31.75 91.44,31.75 96.52,36.83 96.52,59.37 95.25,60.64 91.12,60.64 89.61,62.15 | R14.1 74.46,32.38
  Top 0.813: 74.46,32.38 74.61,32.38
VCC_IN
  Top 0.254: IC1.8 77.78,4.4
  Top 0.61: 77.47,2.22 IC1.8 | 73.66,2.22 IC1.5 | 77.78,4.4 C15.1
  Top 0.813: 77.47,2.22 76.83,1.59 74.3,1.59 73.66,2.22
  Top 1.27: C15.1 80.01,3.17 81.92,1.27 87.63,1.27 VCC_IN.MP 91.3,4.93 D1.A
VDD  (via drill 0.6, 1, 1.1)
  Top 0.254: U$1.54 44.43,50.16 43.81,50.16 43.43,50.55 U$1.56 43.43,52.45 43.18,52.7 42.23,52.7 41.93,52.41 | U$1.7 U$1.8 | U$1.19 40.43,39.58 | C16.1 38.72,67.19 | U$1.19 40.43,38.73 41.59,38.73 | 41.59,39.82 U$1.21 U$1.22 | 40.43,46.78 40.32,46.67 | 40.32,41.59 arc-90 40.43,41.48 U$1.19 | v40.64,46.99 40.43,46.78 | 40.43,46.78 40.24,46.97 | v71.75,13.97 71.67,13.89 | 26.35,69.53 C26.1 | 41.93,52.41 41.91,52.39 | 41.93,52.41 U$1.59 41.93,48.28
  Top 0.406: U$1.1 U$1.2 U$1.3 U$1.4 U$1.5 U$1.6 U$1.7 | 36.04,67.94 R11.2 | U$3.7 23.5,31.75 | 38.72,67.19 IC2.5 | 71.67,12.2 C13.2 | 23.18,64.14 U$2.7
  Top 0.61: 23.5,31.75 arc90 24.13,32.38 | 41.59,38.73 41.59,39.82 | 40.32,46.67 40.32,41.59 | 40.24,46.97 U$1.6 | 24.77,65.72 arc-90 23.18,64.14 | v40.64,46.99 41.93,48.28 | 77.47,12.7 IC1.1 | v76.2,12.06 IC1.2
  Top 0.813: 24.13,32.38 24.13,36.2 arc90 v22.86,37.47 arc-90 21.59,38.73 21.59,39.1 C27.1 | 37.15,67.94 36.04,67.94 | 37.15,67.94 v37.15,69.53 26.35,69.53 arc90 24.77,67.94 24.77,65.72 | 37.15,67.94 C16.1
  Top 1.016: 77.47,12.7 76.52,13.65 71.67,13.65
  Top 1.27: C23.1 71.67,12.2 71.67,13.65 71.67,13.89
  Bottom 0.305: 42.23,41.59 41.91,41.91 41.91,46.99 v40.64,46.99
  Bottom 0.406: 46.67,75.88 EXT.2
  Bottom 0.61: C9.1 40.64,45.99 v40.64,46.99 40.66,47.62 40.64,47.6 40.67,48.88 C11.1 | v76.2,12.06 72.71,15.56 68.26,15.56 42.23,41.59
  Bottom 1.27: 40.64,50.8 40.64,47.6 v40.64,46.99 | v37.15,69.53 37.15,54.29 40.64,50.8 | 46.67,75.88 46.67,56.83 40.64,50.8 | v22.86,37.47 22.86,41.27 32.38,50.8 40.64,50.8
  Bottom 1.676: v40.64,46.99 40.64,40.96
  Bottom 1.778: v71.75,13.97 67.63,13.97 40.64,40.96

### Text on the board
Bottom: (c) 2011 by Sebastian Götte | (cc) by-sa
tNames: Inv | OpenMind v0.1.3 | Non-Inv | Inv | Non-Inv | Inv | Non-Inv | Non-Inv | Inv